# EAGLE design 150224_AriloRX_REV2_0_0_V2 (EAGLE 6.5.0)
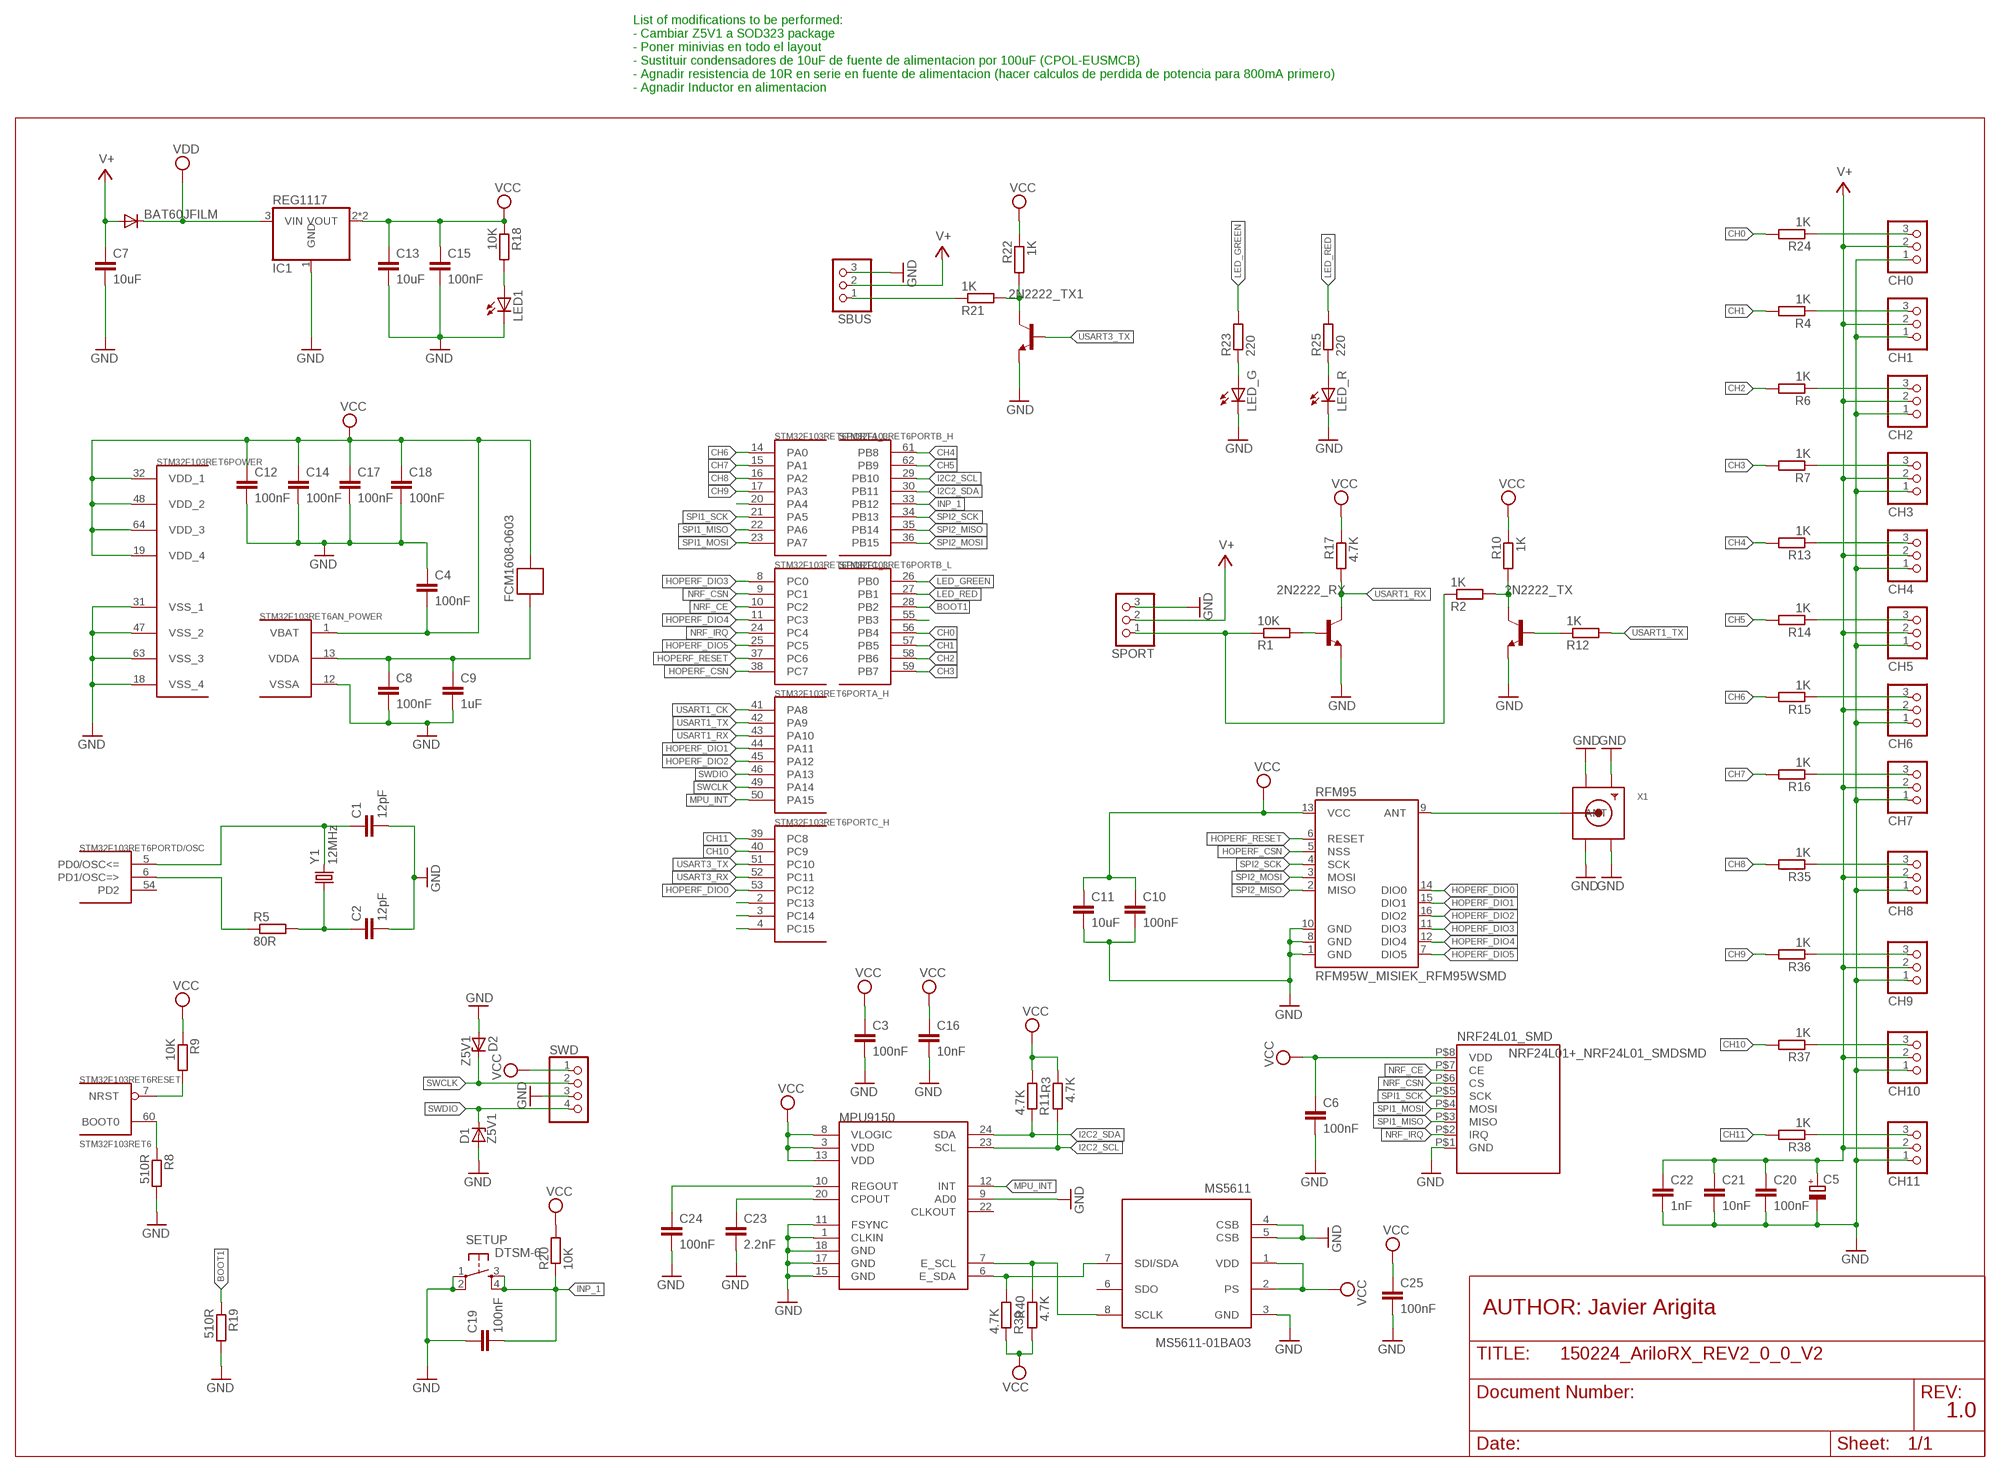
[diagram p0: schematic, sheet 1]

## Parts
2N2222_RX  MMBT2222ALT1-NPN-SOT23-BEC  [SOT23-BEC]
2N2222_TX  MMBT2222ALT1-NPN-SOT23-BEC  [SOT23-BEC]
2N2222_TX1  MMBT2222ALT1-NPN-SOT23-BEC  [SOT23-BEC]
BAT60JFILM  DIODE-SOD323-R  [SOD323-R]
C1  12pF  RESISTOR_C-EUC0603  [RESISTOR_C0603]
C2  12pF  RESISTOR_C-EUC0603  [RESISTOR_C0603]
C3  100nF  RESISTOR_C-EUC0603  [RESISTOR_C0603]
C4  100nF  RESISTOR_C-EUC0603  [RESISTOR_C0603]
C5  CPOL-EUSMCB  [SMC_B]
C6  100nF  RESISTOR_C-EUC0603  [RESISTOR_C0603]
C7  10uF  RESISTOR_C-EUC3216  [RESISTOR_C3216]
C8  100nF  RESISTOR_C-EUC0603  [RESISTOR_C0603]
C9  1uF  RESISTOR_C-EUC0603  [RESISTOR_C0603]
C10  100nF  RESISTOR_C-EUC0603  [RESISTOR_C0603]
C11  10uF  RESISTOR_C-EUC3216  [RESISTOR_C3216]
C12  100nF  RESISTOR_C-EUC0603  [RESISTOR_C0603]
C13  10uF  RESISTOR_C-EUC3216  [RESISTOR_C3216]
C14  100nF  RESISTOR_C-EUC0603  [RESISTOR_C0603]
C15  100nF  RESISTOR_C-EUC0603  [RESISTOR_C0603]
C16  10nF  RESISTOR_C-EUC0603  [RESISTOR_C0603]
C17  100nF  RESISTOR_C-EUC0603  [RESISTOR_C0603]
C18  100nF  RESISTOR_C-EUC0603  [RESISTOR_C0603]
C19  100nF  RESISTOR_C-EUC0603  [RESISTOR_C0603]
C20  100nF  RESISTOR_C-EUC0603  [RESISTOR_C0603]
C21  10nF  RESISTOR_C-EUC0603  [RESISTOR_C0603]
C22  1nF  RESISTOR_C-EUC0603  [RESISTOR_C0603]
C23  2.2nF  RESISTOR_C-EUC0603  [RESISTOR_C0603]
C24  100nF  RESISTOR_C-EUC0603  [RESISTOR_C0603]
C25  100nF  RESISTOR_C-EUC0603  [RESISTOR_C0603]
CH0  PINHD-1X3  [1X03]
CH1  PINHD-1X3  [1X03]
CH2  PINHD-1X3  [1X03]
CH3  PINHD-1X3  [1X03]
CH4  PINHD-1X3  [1X03]
CH5  PINHD-1X3  [1X03]
CH6  PINHD-1X3  [1X03]
CH7  PINHD-1X3  [1X03]
CH8  PINHD-1X3  [1X03]
CH9  PINHD-1X3  [1X03]
CH10  PINHD-1X3  [1X03]
CH11  PINHD-1X3  [1X03]
D1  Z5V1  ZENER-DIODESOD80C  [SOD80C]
D2  Z5V1  ZENER-DIODESOD80C  [SOD80C]
FCM1608-0603  FERRITE-BEAD  [R0603]
IC1  REG1117  [SOT223]
LED1  LED_LEDCHIP-LED0603  [LED_CHIP-LED0603]
LED_G  LEDCHIP-LED0603  [CHIP-LED0603]
LED_R  LEDCHIP-LED0603  [CHIP-LED0603]
MPU9150  MPU-9150QFN-24-NP  [QFN-24-NP]
MS5611  MS5611-01BA03  [SON125P300X500X100-8N]
NRF24L01_SMD  NRF24L01+_NRF24L01_SMDSMD  [NRF24L01+_NRF24L01_SMD]
R1  10K  RCL_R-EU_R0603  [RCL_R0603]
R2  1K  RCL_R-EU_R0603  [RCL_R0603]
R3  4.7K  RCL_R-EU_R0603  [RCL_R0603]
R4  1K  RCL_R-EU_R0603  [RCL_R0603]
R5  80R  RCL_R-EU_R0603  [RCL_R0603]
R6  1K  RCL_R-EU_R0603  [RCL_R0603]
R7  1K  RCL_R-EU_R0603  [RCL_R0603]
R8  510R  RCL_R-EU_R0603  [RCL_R0603]
R9  10K  RCL_R-EU_R0603  [RCL_R0603]
R10  1K  RCL_R-EU_R0603  [RCL_R0603]
R11  4.7K  RCL_R-EU_R0603  [RCL_R0603]
R12  1K  RCL_R-EU_R0603  [RCL_R0603]
R13  1K  RCL_R-EU_R0603  [RCL_R0603]
R14  1K  RCL_R-EU_R0603  [RCL_R0603]
R15  1K  RCL_R-EU_R0603  [RCL_R0603]
R16  1K  RCL_R-EU_R0603  [RCL_R0603]
R17  4.7K  RCL_R-EU_R0603  [RCL_R0603]
R18  10K  RCL_R-EU_R0603  [RCL_R0603]
R19  510R  RCL_R-EU_R0603  [RCL_R0603]
R20  10K  RCL_R-EU_R0603  [RCL_R0603]
R21  1K  RCL_R-EU_R0603  [RCL_R0603]
R22  1K  RCL_R-EU_R0603  [RCL_R0603]
R23  220  RCL_R-EU_R0603  [RCL_R0603]
R24  1K  RCL_R-EU_R0603  [RCL_R0603]
R25  220  RCL_R-EU_R0603  [RCL_R0603]
R35  1K  RCL_R-EU_R0603  [RCL_R0603]
R36  1K  RCL_R-EU_R0603  [RCL_R0603]
R37  1K  RCL_R-EU_R0603  [RCL_R0603]
R38  1K  RCL_R-EU_R0603  [RCL_R0603]
R39  4.7K  RCL_R-EU_R0603  [RCL_R0603]
R40  4.7K  RCL_R-EU_R0603  [RCL_R0603]
RFM95  RFM95W_MISIEK_RFM95WSMD  [RFM95W_MISIEK_RFM95W_SMD]
SBUS  PINHD-1X3  [1X03]
SETUP  DTSM-6  [DTSM-6]
SPORT  PINHD-1X3  [1X03]
STM32F103RET6  STM32F103RET6  STM32F10XRXT6  [TQFP64]
SWD  PINHD-1X4  [1X04]
X1  SMACONNECTOR_EDGE  [SMA_EDGELAUNCH]
Y1  12MHz  CRYSTAL5X3  [CRYSTAL-SMD-5X3]

## Nets
BOOT1: R19.1 STM32F103RET6.28(PORTB_L:PB2)
CH0: R24.2 STM32F103RET6.56(PORTB_L:PB4)
CH1: R4.2 STM32F103RET6.57(PORTB_L:PB5)
CH2: R6.2 STM32F103RET6.58(PORTB_L:PB6)
CH3: R7.2 STM32F103RET6.59(PORTB_L:PB7)
CH4: R13.2 STM32F103RET6.61(PORTB_H:PB8)
CH5: R14.2 STM32F103RET6.62(PORTB_H:PB9)
CH6: R15.2 STM32F103RET6.14(PORTA_L:PA0)
CH7: R16.2 STM32F103RET6.15(PORTA_L:PA1)
CH8: R35.2 STM32F103RET6.16(PORTA_L:PA2)
CH9: R36.2 STM32F103RET6.17(PORTA_L:PA3)
CH10: R37.2 STM32F103RET6.40(PORTC_H:PC9)
CH11: R38.2 STM32F103RET6.39(PORTC_H:PC8)
GND: 2N2222_RX.E 2N2222_TX1.E 2N2222_TX.E C1.2 C2.2 C3.2 C4.1 C5.- C6.2 C7.2 C8.2 C9.2 C10.2 C11.2 C12.2 C13.2 C14.2 C15.2 C16.2 C17.2 C18.2 C19.1 C20.2 C21.2 C22.2 C23.2 C24.2 C25.2 CH0.1 CH1.1 CH2.1 CH3.1 CH4.1 CH5.1 CH6.1 CH7.1 CH8.1 CH9.1 CH10.1 CH11.1 D1.A D2.A IC1.1(GND) LED1.C LED_G.C LED_R.C MPU9150.1(CLKIN) MPU9150.9(AD0) MPU9150.11(FSYNC) MPU9150.15(GND) MPU9150.17(GND) MPU9150.18(GND) MS5611.3(GND) MS5611.4(CSB) MS5611.5(CSB) NRF24L01_SMD.P$1(GND) R8.2 R19.2 RFM95.1(GND) RFM95.8(GND) RFM95.10(GND) SBUS.3 SETUP.1 SETUP.2 SPORT.3 STM32F103RET6.12(AN_POWER:VSSA) STM32F103RET6.18(POWER:VSS_4) STM32F103RET6.31(POWER:VSS_1) STM32F103RET6.47(POWER:VSS_2) STM32F103RET6.63(POWER:VSS_3) SWD.3 X1.GND@1(GND4) X1.GND@2(GND3) X1.GND@3(GND2) X1.GND@4(GND1)
HOPERF_CSN: RFM95.5(NSS) STM32F103RET6.38(PORTC_L:PC7)
HOPERF_DIO0: RFM95.14(DIO0) STM32F103RET6.53(PORTC_H:PC12)
HOPERF_DIO1: RFM95.15(DIO1) STM32F103RET6.44(PORTA_H:PA11)
HOPERF_DIO2: RFM95.16(DIO2) STM32F103RET6.45(PORTA_H:PA12)
HOPERF_DIO3: RFM95.11(DIO3) STM32F103RET6.8(PORTC_L:PC0)
HOPERF_DIO4: RFM95.12(DIO4) STM32F103RET6.11(PORTC_L:PC3)
HOPERF_DIO5: RFM95.7(DIO5) STM32F103RET6.25(PORTC_L:PC5)
HOPERF_RESET: RFM95.6(RESET) STM32F103RET6.37(PORTC_L:PC6)
I2C2_SCL: MPU9150.23(SCL) R3.2 STM32F103RET6.29(PORTB_H:PB10)
I2C2_SDA: MPU9150.24(SDA) R11.1 STM32F103RET6.30(PORTB_H:PB11)
INP_1: C19.2 R20.1 SETUP.3 SETUP.4 STM32F103RET6.33(PORTB_H:PB12)
LED_GREEN: R23.2 STM32F103RET6.26(PORTB_L:PB0)
LED_RED: R25.2 STM32F103RET6.27(PORTB_L:PB1)
MPU_INT: MPU9150.12(INT) STM32F103RET6.50(PORTA_H:PA15)
N$1: C1.1 STM32F103RET6.5(PORTD/OSC:PD0/OSC<=) Y1.3
N$2: R5.1 STM32F103RET6.6(PORTD/OSC:PD1/OSC=>)
N$3: C2.1 R5.2 Y1.1
N$4: R8.1 STM32F103RET6.60(RESET:BOOT0)
N$5: 2N2222_TX.C R2.2 R10.2
N$6: STM32F103RET6.20(PORTA_L:PA4)
N$7: RFM95.9(ANT) X1.P(ANT)
N$8: 2N2222_TX.B R12.1
N$9: CH0.3 R24.1
N$10: LED1.A R18.2
N$11: 2N2222_TX1.C R21.2 R22.2
N$12: LED_G.A R23.1
N$13: CH8.3 R35.1
N$14: R1.1 R2.1 SPORT.1
N$15: LED_R.A R25.1
N$16: 2N2222_RX.B R1.2
N$17: C8.1 C9.1 FCM1608-0603.2 STM32F103RET6.13(AN_POWER:VDDA)
N$20: STM32F103RET6.2(PORTC_H:PC13)
N$21: CH2.3 R6.1
N$22: STM32F103RET6.3(PORTC_H:PC14)
N$23: CH4.3 R13.1
N$24: STM32F103RET6.4(PORTC_H:PC15)
N$25: CH9.3 R36.1
N$26: CH10.3 R37.1
N$27: CH11.3 R38.1
N$28: MPU9150.7(E_SCL) MS5611.8(SCLK) R40.1
N$29: MPU9150.6(E_SDA) MS5611.7(SDI/SDA) R39.2
N$30: STM32F103RET6.55(PORTB_L:PB3)
N$31: CH3.3 R7.1
N$32: CH6.3 R15.1
N$33: C23.1 MPU9150.20(CPOUT)
N$34: CH5.3 R14.1
N$35: CH7.3 R16.1
N$40: C24.1 MPU9150.10(REGOUT)
N$53: CH1.3 R4.1
NRF_CE: NRF24L01_SMD.P$7(CE) STM32F103RET6.10(PORTC_L:PC2)
NRF_CSN: NRF24L01_SMD.P$6(CS) STM32F103RET6.9(PORTC_L:PC1)
NRF_IRQ: NRF24L01_SMD.P$2(IRQ) STM32F103RET6.24(PORTC_L:PC4)
NSRST: R9.2 STM32F103RET6.7(RESET:NRST)
SBUS: R21.1 SBUS.1
SPI1_MISO: NRF24L01_SMD.P$3(MISO) STM32F103RET6.22(PORTA_L:PA6)
SPI1_MOSI: NRF24L01_SMD.P$4(MOSI) STM32F103RET6.23(PORTA_L:PA7)
SPI1_SCK: NRF24L01_SMD.P$5(SCK) STM32F103RET6.21(PORTA_L:PA5)
SPI2_MISO: RFM95.2(MISO) STM32F103RET6.35(PORTB_H:PB14)
SPI2_MOSI: RFM95.3(MOSI) STM32F103RET6.36(PORTB_H:PB15)
SPI2_SCK: RFM95.4(SCK) STM32F103RET6.34(PORTB_H:PB13)
SWCLK: D2.C STM32F103RET6.49(PORTA_H:PA14) SWD.2
SWDIO: D1.C STM32F103RET6.46(PORTA_H:PA13) SWD.4
USART1_CK: STM32F103RET6.41(PORTA_H:PA8)
USART1_RX: 2N2222_RX.C R17.2 STM32F103RET6.43(PORTA_H:PA10)
USART1_TX: R12.2 STM32F103RET6.42(PORTA_H:PA9)
USART3_RX: STM32F103RET6.52(PORTC_H:PC11)
USART3_TX: 2N2222_TX1.B STM32F103RET6.51(PORTC_H:PC10)
V+: BAT60JFILM.A C5.+ C7.1 C20.1 C21.1 C22.1 CH0.2 CH1.2 CH2.2 CH3.2 CH4.2 CH5.2 CH6.2 CH7.2 CH8.2 CH9.2 CH10.2 CH11.2 SBUS.2 SPORT.2
VCC: C3.1 C4.2 C6.1 C10.1 C11.1 C12.1 C13.1 C14.1 C15.1 C16.1 C17.1 C18.1 C25.1 FCM1608-0603.1 IC1.2(VOUT) IC1.4(VOUT) MPU9150.3(VDD) MPU9150.8(VLOGIC) MPU9150.13(VDD) MS5611.1(VDD) MS5611.2(PS) NRF24L01_SMD.P$8(VDD) R3.1 R9.1 R10.1 R11.2 R17.1 R18.1 R20.2 R22.1 R39.1 R40.2 RFM95.13(VCC) STM32F103RET6.1(AN_POWER:VBAT) STM32F103RET6.19(POWER:VDD_4) STM32F103RET6.32(POWER:VDD_1) STM32F103RET6.48(POWER:VDD_2) STM32F103RET6.64(POWER:VDD_3) SWD.1
VDD: BAT60JFILM.C IC1.3(VIN)
Unconnected: MPU9150.22(CLKOUT) MS5611.6(SDO) STM32F103RET6.54(PORTD/OSC:PD2)

## Notes on the sheet
- List of modifications to be performed:
  - Cambiar Z5V1 a SOD323 package
  - Poner minivias en todo el layout
  - Sustituir condensadores de 10uF de fuente de alimentacion por 100uF (CPOL-EUSMCB)
  - Agnadir resistencia de 10R en serie en fuente de alimentacion (hacer calculos de perdida de potencia para 800mA primero)
  - Agnadir Inductor en alimentacion
- AUTHOR: Javier Arigita
- 1.0

## Library data of the parts
2N2222_RX 2N2222_TX 2N2222_TX1 = transistor:*-NPN-: NPN Transistror BF959 corrected 2008.03.06
BAT60JFILM = diode:DIODE-: DIODE
C1-C4 C6-C25 = AriloTX:RESISTOR_C-EU: CAPACITOR, European symbol
C5 = rcl:CPOL-EU: POLARIZED CAPACITOR, European symbol
CH0 CH1-CH11 SBUS SPORT = pinhead_rc:PINHD-1X3: PIN HEADER
D1 D2 = diode:ZENER-DIODE: Z-Diode
FCM1608-0603 = BaseApp:FERRITE-BEAD
IC1 = CEDT:REG1117: 800mA and 1A Low Dropout (LDO) Positive Regulator 1.8V, 2.5V, 2.85V, 3.3V, 5V, and Adj
LED1 = AriloTX:LED_LED: LED OSRAM: - CHIPLED LG R971, LG N971, LY N971, LG Q971, LY Q971, LO R971, LY R971 LH N974, LH R974 LS Q976, LO Q976, LY Q976 LO Q996 - Hyper CHIPLED LW Q18S LB Q993, LB Q99A, LB R99A - SideLED LS A670, LO A670, LY A670, LG A670, LP A670 LB A673, LV A673, LT A673, LW A673 LH A674 LY A675 LS A676, LA A676, LO A676, LY A676, LW A676 LS A679, LY A679, LG A679 - Hyper Micro SIDELED® LS Y876, LA Y876, LO Y876, LY Y876 LT Y87S - SmartLED LW L88C, LW L88S LB L89C, LB L89S, LG L890 LS L89K, LO L89K, LY L89K LS L896, LA L896, LO L896, LY L896 - TOPLED LS T670, LO T670, LY T670, LG T670, LP T670 LSG T670, LSP T670, LSY T670, LOP T670, LYG T670 LG T671, LOG T671, LSG T671 LB T673, LV T673, LT T673, LW T673 LH T674 LS T676, LA T676, LO T676, LY T676, LB T676, LH T676, LSB T676, LW T676 LB T67C, LV T67C, LT T67C, LS T67K, LO T67K, LY T67K, LW E67C LS E67B, LA E67B, LO E67B, LY E67B, LB E67C, LV E67C, LT E67C LW T67C LS T679, LY T679, LG T679 LS T770, LO T770, LY T770, LG T770, LP T770 LB T773, LV T773, LT T773, LW T773 LH T774 LS E675, LA E675, LY E675, LS T675 LS T776, LA T776, LO T776, LY T776, LB T776 LHGB T686 LT T68C, LB T68C - Hyper Mini TOPLED® LB M676 - Mini TOPLED Santana® LG M470 LS M47K, LO M47K, LY M47K Source: http://www.osram.convergy.de LUXEON: - LUMILED® LXK2-PW12-R00, LXK2-PW12-S00, LXK2-PW14-U00, LXK2-PW14-V00 LXK2-PM12-R00, LXK2-PM12-S00, LXK2-PM14-U00 LXK2-PE12-Q00, LXK2-PE12-R00, LXK2-PE12-S00, LXK2-PE14-T00, LXK2-PE14-U00 LXK2-PB12-K00, LXK2-PB12-L00, LXK2-PB12-M00, LXK2-PB14-N00, LXK2-PB14-P00, LXK2-PB14-Q00 LXK2-PR12-L00, LXK2-PR12-M00, LXK2-PR14-Q00, LXK2-PR14-R00 LXK2-PD12-Q00, LXK2-PD12-R00, LXK2-PD12-S00 LXK2-PH12-R00, LXK2-PH12-S00 LXK2-PL12-P00, LXK2-PL12-Q00, LXK2-PL12-R00 Source: www.luxeon.com KINGBRIGHT: KA-3528ASYC Source: www.kingbright.com
LED_G LED_R = led:LED: LED OSRAM: - CHIPLED LG R971, LG N971, LY N971, LG Q971, LY Q971, LO R971, LY R971 LH N974, LH R974 LS Q976, LO Q976, LY Q976 LO Q996 - Hyper CHIPLED LW Q18S LB Q993, LB Q99A, LB R99A - SideLED LS A670, LO A670, LY A670, LG A670, LP A670 LB A673, LV A673, LT A673, LW A673 LH A674 LY A675 LS A676, LA A676, LO A676, LY A676, LW A676 LS A679, LY A679, LG A679 - Hyper Micro SIDELED® LS Y876, LA Y876, LO Y876, LY Y876 LT Y87S - SmartLED LW L88C, LW L88S LB L89C, LB L89S, LG L890 LS L89K, LO L89K, LY L89K LS L896, LA L896, LO L896, LY L896 - TOPLED LS T670, LO T670, LY T670, LG T670, LP T670 LSG T670, LSP T670, LSY T670, LOP T670, LYG T670 LG T671, LOG T671, LSG T671 LB T673, LV T673, LT T673, LW T673 LH T674 LS T676, LA T676, LO T676, LY T676, LB T676, LH T676, LSB T676, LW T676 LB T67C, LV T67C, LT T67C, LS T67K, LO T67K, LY T67K, LW E67C LS E67B, LA E67B, LO E67B, LY E67B, LB E67C, LV E67C, LT E67C LW T67C LS T679, LY T679, LG T679 LS T770, LO T770, LY T770, LG T770, LP T770 LB T773, LV T773, LT T773, LW T773 LH T774 LS E675, LA E675, LY E675, LS T675 LS T776, LA T776, LO T776, LY T776, LB T776 LHGB T686 LT T68C, LB T68C - Hyper Mini TOPLED® LB M676 - Mini TOPLED Santana® LG M470 LS M47K, LO M47K, LY M47K Source: http://www.osram.convergy.de LUXEON: - LUMILED® LXK2-PW12-R00, LXK2-PW12-S00, LXK2-PW14-U00, LXK2-PW14-V00 LXK2-PM12-R00, LXK2-PM12-S00, LXK2-PM14-U00 LXK2-PE12-Q00, LXK2-PE12-R00, LXK2-PE12-S00, LXK2-PE14-T00, LXK2-PE14-U00 LXK2-PB12-K00, LXK2-PB12-L00, LXK2-PB12-M00, LXK2-PB14-N00, LXK2-PB14-P00, LXK2-PB14-Q00 LXK2-PR12-L00, LXK2-PR12-M00, LXK2-PR14-Q00, LXK2-PR14-R00 LXK2-PD12-Q00, LXK2-PD12-R00, LXK2-PD12-S00 LXK2-PH12-R00, LXK2-PH12-S00 LXK2-PL12-P00, LXK2-PL12-Q00, LXK2-PL12-R00 Source: www.luxeon.com KINGBRIGHT: KA-3528ASYC Source: www.kingbright.com
MPU9150 = SparkFun-Sensors:MPU-9150: 9DOF (3mag, 3accel, 3rotat). I2C interface.
MS5611 = Measurement-Specialties:MS5611-01BA03: Variometer Module, with stainless steel cap
NRF24L01_SMD = Arilo_TX140810_AriloTX_REV3_0_0_868MHZ_td:NRF24L01+_NRF24L01_SMD
R1-R25 R35-R40 = AriloTX:RCL_R-EU_: RESISTOR, European symbol
RFM95 = AriloTX:RFM95W_MISIEK_RFM95W
SETUP = switch-tact:DTSM-6
STM32F103RET6 = stm32:STM32F10XRXT6: STM32F101/103 64pin LQFP
SWD = pinhead:PINHD-1X4: PIN HEADER
X1 = adafruit:SMACONNECTOR: SMA Connector 90° DIP SMA Connector, 50 Ohm (4UConnector: 07259)
Y1 = SparkFun-FreqCtrl:CRYSTAL: Various standard crystals. Proven footprints. Spark Fun Electronics SKU : COM-00534

## Board
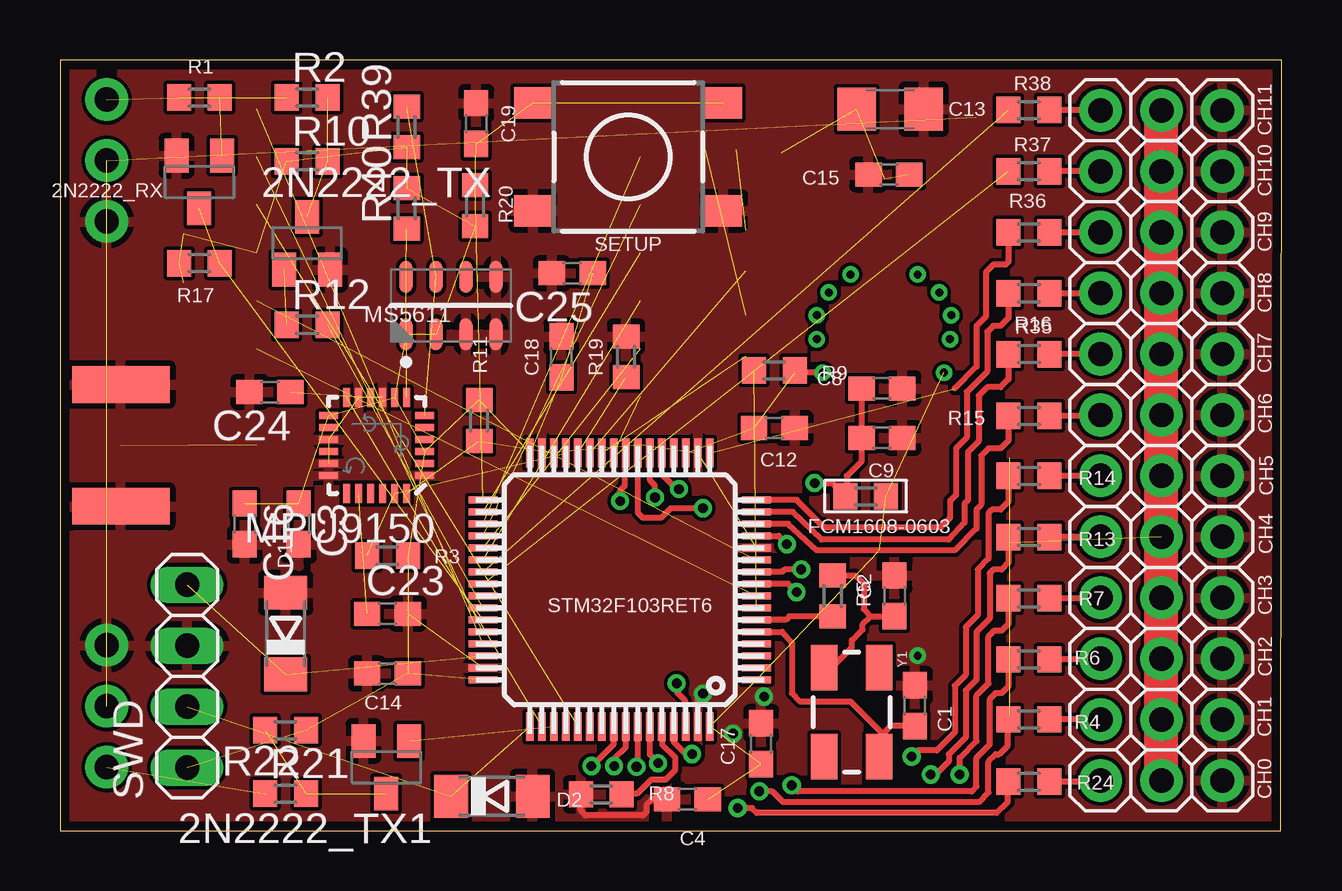
[diagram p1: board, top side]
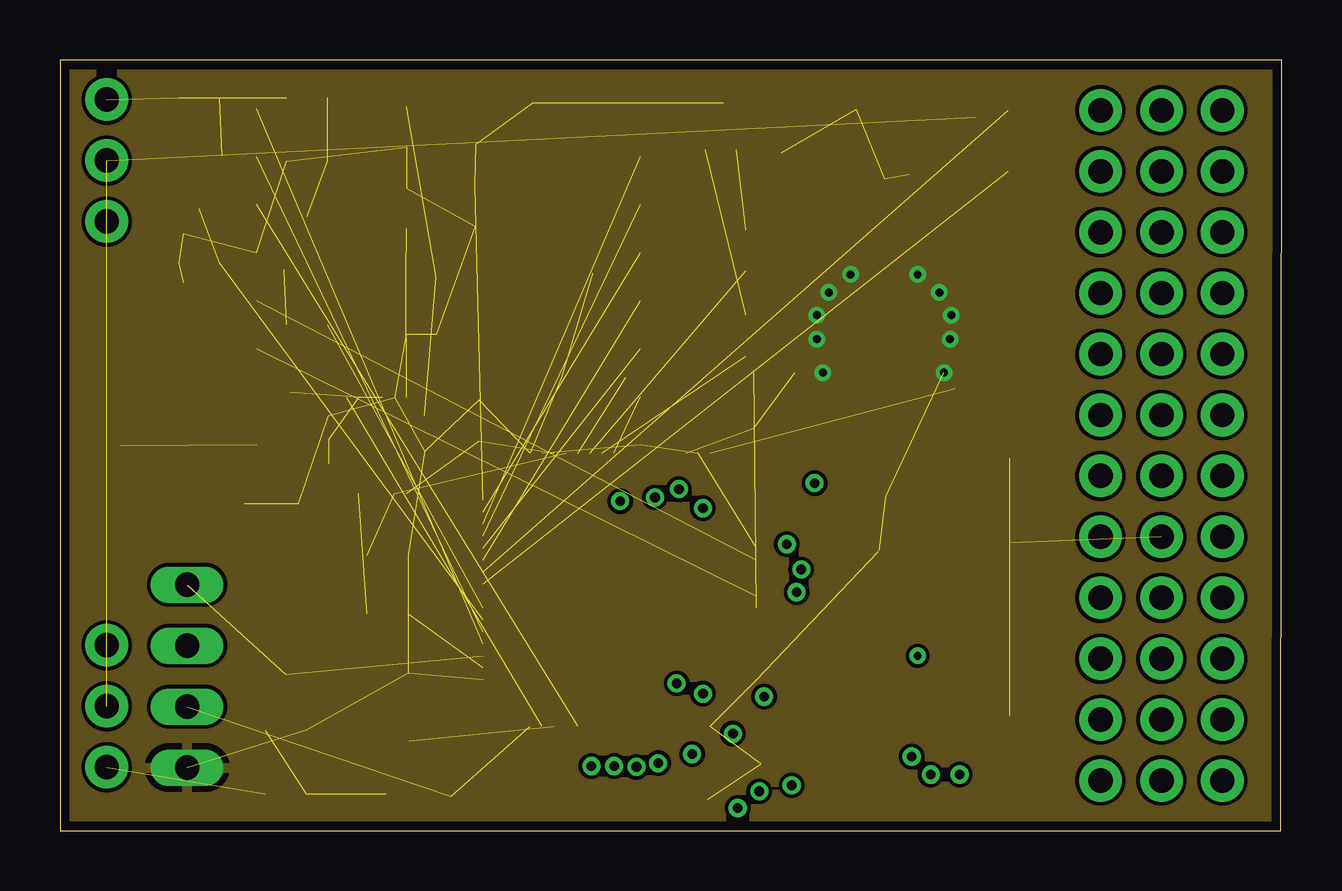
[diagram p2: board, inner layer Route2]
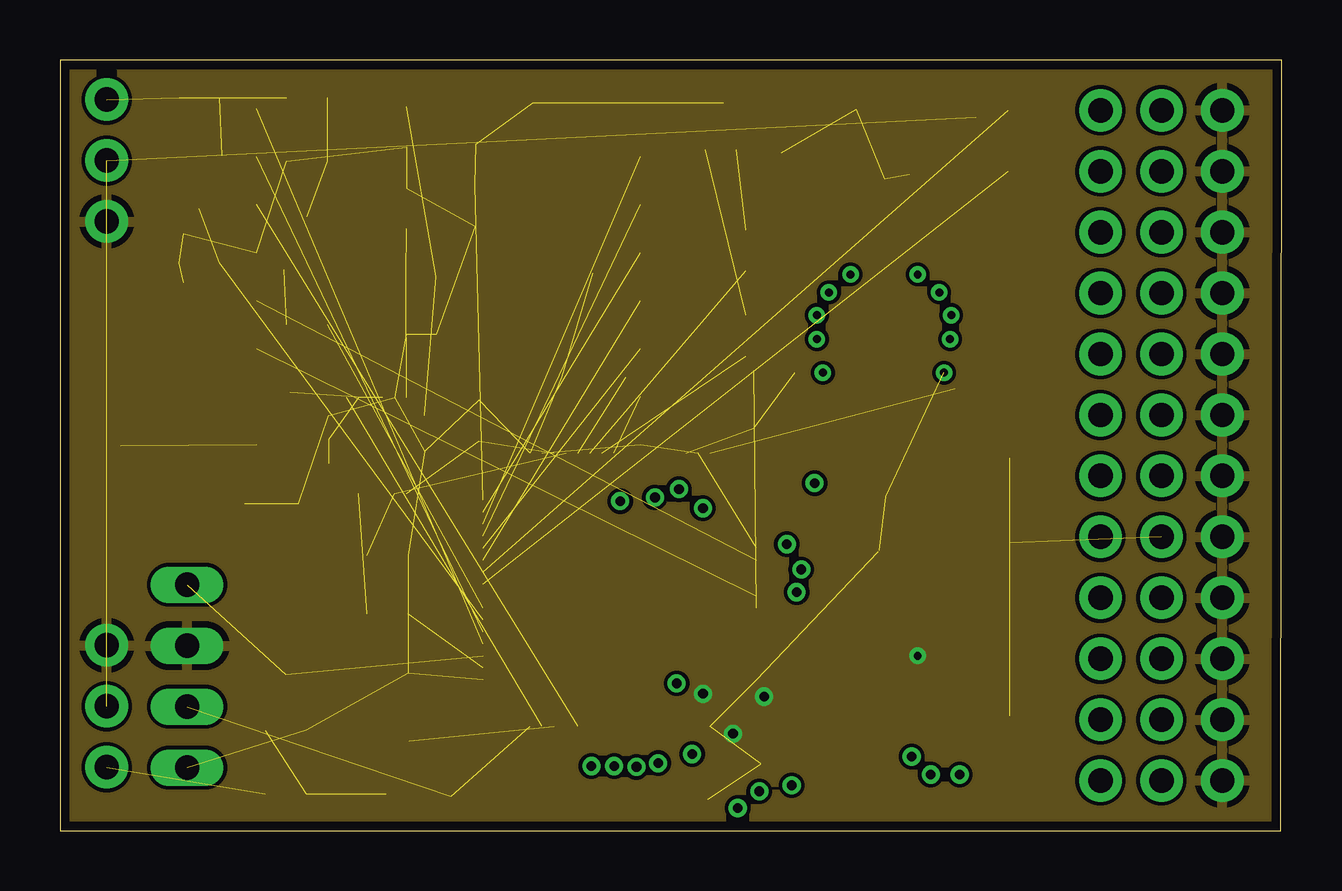
[diagram p3: board, inner layer Route15]
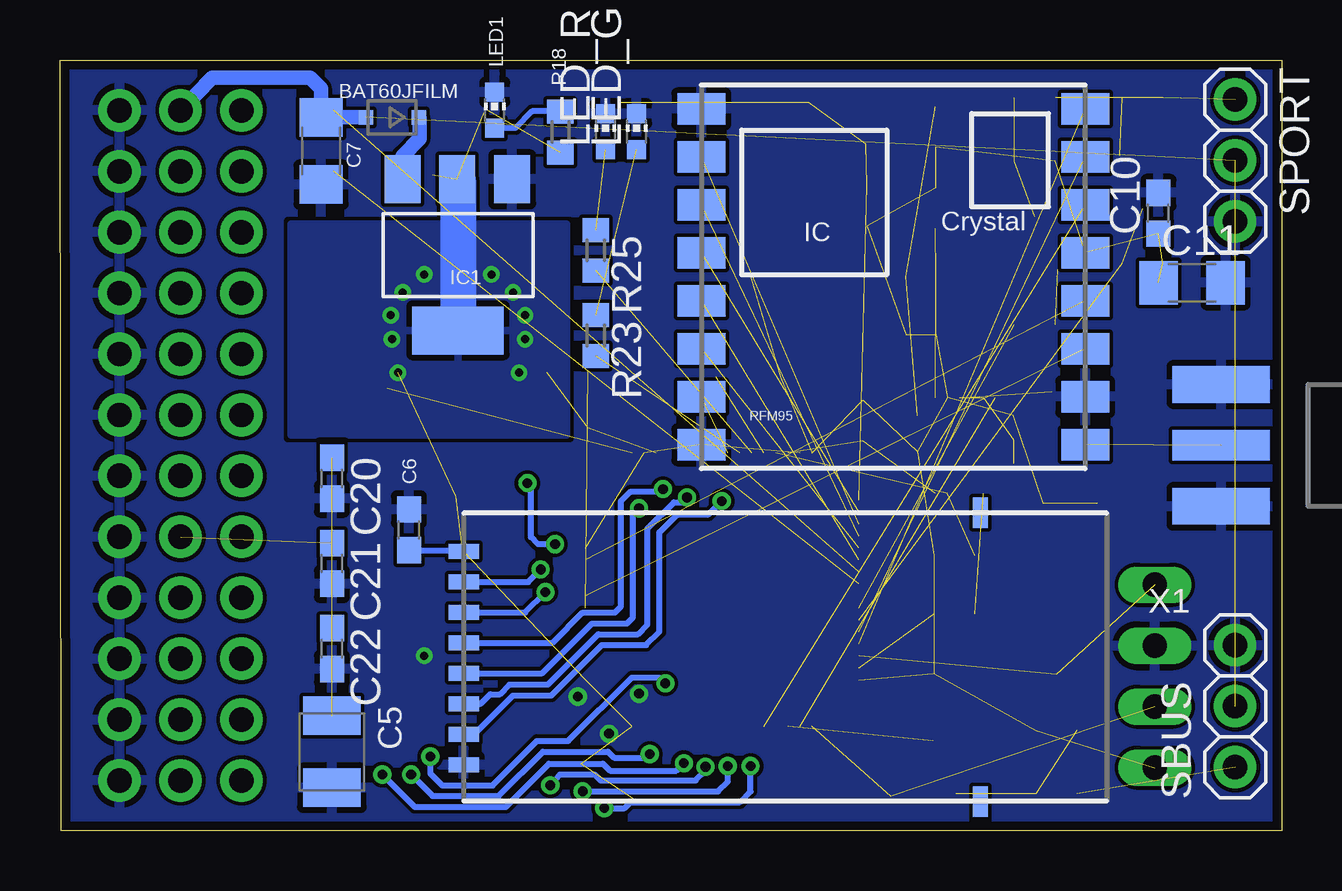
[diagram p4: board, bottom side, seen from below]

Size 50.94 x 32.14 mm. Coordinates in mm from the lower left corner, seen from the top.
Outline: 0,0 50.88,0 50.94,32.14 0,32.14 0,0
Copper layers (1*2*15*16): Top 0.0356mm / dielectric 0.17018125mm / Route2 0.0178mm / dielectric 47mil / Route15 0.0178mm / dielectric 0.17018125mm / Bottom 0.0356mm
Design rules "LaenPCBOrder *": minimum track width 6mil, minimum drill 13mil, track to track 6mil, track to pad 6mil, pad to pad 6mil, via to via 6mil, smd to smd 6mil, copper to edge 15mil, drill to drill 6mil, minimum pad ring 7mil, minimum via ring 7mil, stop-mask expansion 4mil, vias tented up to drill 0mil, thermal gap 10mil

### Footprints (pad centres in the part's own frame; a part is rotated, then mirrored left to right if it is on the bottom)
SOT23-BEC = smd 1 x 1.4: B -0.95,-1.1; C 0,1.1; E 0.95,-1.1
SOD323-R = smd 0.6 x 0.6: A 1.1,0; C -1.1,0
RESISTOR_C0603 = smd 1.1 x 1: 1 -0.85,0; 2 0.85,0
SMC_B = smd 1.6 x 2.4: + -1.5,0; - 1.5,0
RESISTOR_C3216 = smd 1.6 x 1.8: 1 -1.4,0; 2 1.4,0
1X03 = drill 1.016 pad 1.778: 1 -2.54,0; 2 0,0; 3 2.54,0
SOD80C = smd 1.4 x 1.8: A 1.7,0; C -1.7,0
R0603 = smd 1 x 1.1: 1 -0.85,0; 2 0.85,0
SOT223 = smd 1.499 x 2.007: 1 -2.261,-3.15; 2 0.025,-3.15; 3 2.311,-3.15 | smd 3.81 x 2.007: 4 0,3.15
LED_CHIP-LED0603 = smd 0.8 x 0.8: A 0,-0.75; C 0,0.75
CHIP-LED0603 = smd 0.8 x 0.8: A 0,-0.75; C 0,0.75
QFN-24-NP = smd 0.8 x 0.3: 1 -2,1.25; 2 -2,0.75; 3 -2,0.25; 4 -2,-0.25; 5 -2,-0.75; 6 -2,-1.25; 13 2,-1.25; 14 2,-0.75; 15 2,-0.25; 16 2,0.25; 17 2,0.75; 18 2,1.25 | smd 0.3 x 0.8: 7 -1.25,-2; 8 -0.75,-2; 9 -0.25,-2; 10 0.25,-2; 11 0.75,-2; 12 1.25,-2; 19 1.25,2; 20 0.75,2; 21 0.25,2; 22 -0.25,2; 23 -0.75,2; 24 -1.25,2
SON125P300X500X100-8N = smd 1.35 x 0.55: 1 -1.2,1.875; 2 -1.2,0.625; 3 -1.2,-0.625; 4 -1.2,-1.875; 5 1.2,-1.875; 6 1.2,-0.625; 7 1.2,0.625; 8 1.2,1.875
NRF24L01+_NRF24L01_SMD = smd 1.27 x 0.635: P$1 26.807,10.492; P$2 26.807,9.222; P$3 26.807,7.952; P$4 26.807,6.682; P$5 26.807,5.412; P$6 26.807,4.142; P$7 26.807,2.872; P$8 26.807,1.602 | smd 0.635 x 1.27: P$11 5.267,-0.018; P$13 5.267,12.032
RCL_R0603 = smd 1 x 1.1: 1 -0.85,0; 2 0.85,0
RFM95W_MISIEK_RFM95W_SMD = smd 2 x 1.3: 1 -8,7; 2 -8,5; 3 -8,3; 4 -8,1; 5 -8,-1; 6 -8,-3; 7 -8,-5; 8 -8,-7; 9 8,-7; 10 8,-5; 11 8,-3; 12 8,-1; 13 8,1; 14 8,3; 15 8,5; 16 8,7
DTSM-6 = smd 1.55 x 1.3: 1 -3.975,2.25; 2 3.975,2.25; 3 -3.975,-2.25; 4 3.975,-2.25
TQFP64 = smd 1.2 x 0.3: 1 -5.7,3.75; 2 -5.7,3.25; 3 -5.7,2.75; 4 -5.7,2.25; 5 -5.7,1.75; 6 -5.7,1.25; 7 -5.7,0.75; 8 -5.7,0.25; 9 -5.7,-0.25; 10 -5.7,-0.75; 11 -5.7,-1.25; 12 -5.7,-1.75; 13 -5.7,-2.25; 14 -5.7,-2.75; 15 -5.7,-3.25; 16 -5.7,-3.75; 33 5.7,-3.75; 34 5.7,-3.25; 35 5.7,-2.75; 36 5.7,-2.25; 37 5.7,-1.75; 38 5.7,-1.25; 39 5.7,-0.75; 40 5.7,-0.25; 41 5.7,0.25; 42 5.7,0.75; 43 5.7,1.25; 44 5.7,1.75; 45 5.7,2.25; 46 5.7,2.75; 47 5.7,3.25; 48 5.7,3.75 | smd 0.3 x 1.2: 17 -3.75,-5.7; 18 -3.25,-5.7; 19 -2.75,-5.7; 20 -2.25,-5.7; 21 -1.75,-5.7; 22 -1.25,-5.7; 23 -0.75,-5.7; 24 -0.25,-5.7; 25 0.25,-5.7; 26 0.75,-5.7; 27 1.25,-5.7; 28 1.75,-5.7; 29 2.25,-5.7; 30 2.75,-5.7; 31 3.25,-5.7; 32 3.75,-5.7; 49 3.75,5.7; 50 3.25,5.7; 51 2.75,5.7; 52 2.25,5.7; 53 1.75,5.7; 54 1.25,5.7; 55 0.75,5.7; 56 0.25,5.7; 57 -0.25,5.7; 58 -0.75,5.7; 59 -1.25,5.7; 60 -1.75,5.7; 61 -2.25,5.7; 62 -2.75,5.7; 63 -3.25,5.7; 64 -3.75,5.7
1X04 = drill 1.016 long: 1 -3.81,0; 2 -1.27,0; 3 1.27,0; 4 3.81,0
SMA_EDGELAUNCH = smd 4.064 x 1.524: GND@1 2.032,-2.54; GND@2 2.032,2.54 | smd 4.064 x 1.524 bottom: GND@3 2.032,2.54; GND@4 2.032,-2.54 | smd 4.064 x 1.27: P 2.032,0
CRYSTAL-SMD-5X3 = smd 1.9 x 1.1: 1 -1.85,-1.15; 2 1.85,-1.15; 3 1.85,1.15; 4 -1.85,1.15

### Placement (x,y rotation side)
2N2222_RX  5.81,27.05 180 top
2N2222_TX  10.3,24.5 0 top
2N2222_TX1  13.6,2.65 180 top
BAT60JFILM  37.09,29.75 180 bottom
C1  35.64,5.22 90 top
C2  34.79,9.8 90 top
C3  9.95,12.8 270 top
C4  26.15,1.32 0 top
C5  39.6,3.3 270 bottom
C6  36.38,12.55 90 bottom
C7  40.05,28.35 270 bottom
C8  34.26,18.45 0 top
C9  34.26,16.39 0 top
C10  5.15,25.75 90 bottom
C11  3.75,22.85 0 bottom
C12  29.77,16.79 0 top
C13  34.6,30.09 0 top
C14  13.65,6.56 180 top
C15  34.55,27.36 180 top
C16  7.7,12.8 270 top
C17  29.23,3.64 90 top
C18  20.9,19.77 90 top
C19  17.35,29.49 270 top
C20  39.6,14.7 270 bottom
C21  39.6,11.15 270 bottom
C22  39.6,7.6 270 bottom
C23  13.65,9.05 0 top
C24  8.75,18.3 180 top
C25  21.35,23.25 180 top
CH0  45.91,2.1 180 top
CH1  45.91,4.64 180 top
CH2  45.91,7.18 180 top
CH3  45.91,9.72 180 top
CH4  45.91,12.26 180 top
CH5  45.91,14.8 180 top
CH6  45.91,17.34 180 top
CH7  45.91,19.88 180 top
CH8  45.91,22.42 180 top
CH9  45.91,24.96 180 top
CH10  45.91,27.5 180 top
CH11  45.91,30.04 180 top
D1  9.41,8.22 90 top
D2  18,1.44 0 top
FCM1608-0603  33.59,13.95 180 top
IC1  34.35,24.02 180 bottom
LED1  32.81,30.05 0 bottom
LED_G  26.9,29.15 0 bottom
LED_R  28.2,29.15 0 bottom
MPU9150  13.2,16.07 180 top
MS5611  16.3,21.9 90 top
NRF24L01_SMD  7.3,13.25 180 bottom
R1  5.81,30.57 0 top
R2  10.3,30.57 0 top
R3  13.65,11.47 180 top
R4  40.38,4.65 180 top
R5  32.21,9.8 90 top
R6  40.38,7.15 180 top
R7  40.38,9.7 180 top
R8  22.56,1.52 180 top
R9  29.77,19.2 180 top
R10  10.3,27.91 0 top
R11  17.48,17.11 90 top
R12  10.3,21.1 0 top
R13  40.38,12.25 180 top
R14  40.38,14.8 180 top
R15  40.38,17.3 180 top
R16  40.38,19.88 180 top
R17  5.81,23.66 0 top
R18  30.07,29.14 90 bottom
R19  23.6,19.77 90 top
R20  17.3,26.07 270 top
R21  9.4,1.55 0 top
R22  9.4,4.2 180 top
R23  28.6,20.65 270 bottom
R24  40.38,2.05 180 top
R25  28.6,24.2 270 bottom
R35  40.38,22.41 180 top
R36  40.38,24.95 180 top
R37  40.38,27.5 180 top
R38  40.38,30.05 180 top
R39  14.45,29.35 90 top
R40  14.45,25.95 90 top
RFM95  16.2,23.1 0 bottom
SBUS  1.95,5.2 90 bottom
SETUP  23.68,28.1 180 top
SPORT  1.95,27.95 270 bottom
STM32F103RET6  23.34,10.05 180 top
SWD  5.3,6.45 90 top
X1  0.5,16.07 180 bottom
Y1  33,4.95 270 top

### Tracks (layer width: path | path; a pad name or v marks a point on that pad's centre or on a via)
BOOT1  (1 unrouted)
CH0  (via drill 0.4 pad 0.25)
  Top 0.254: v28.25,0.95 28.85,0.95 29.05,0.75 39.05,0.75 39.5,1.2 39.5,2.02 R24.2 | v22.15,2.7 23.09,3.63 STM32F103RET6.56
  Bottom 0.254: v28.25,0.95 27.4,0.95 27.15,1.2 22.6,1.2 22.15,1.65 v22.15,2.7
CH1  (via drill 0.4 pad 0.25)
  Top 0.254: v29.15,1.65 29.7,1.65 30.15,1.2 38.3,1.2 38.7,1.6 38.7,2.9 39,3.2 39.15,3.2 39.5,3.55 39.5,4.62 R4.2 | v23.1,2.7 23.1,3 23.59,3.48 STM32F103RET6.57
  Bottom 0.254: v29.15,1.65 23.5,1.65 23.1,2.05 v23.1,2.7
CH2  (via drill 0.4 pad 0.25)
  Top 0.254: v30.5,1.9 30.75,1.65 38,1.65 38.2,1.85 38.2,3.05 38.75,3.6 38.75,5.5 39,5.75 39.25,5.75 39.55,6.05 39.55,7.13 R6.2 | v24.03,2.67 24.09,2.73 STM32F103RET6.58
  Bottom 0.254: v30.5,1.9 30.1,2.35 28.65,2.35 28.4,2.1 24.44,2.1 24.03,2.51 v24.03,2.67
CH3  (via drill 0.4, 0.4 pad 0.25)
  Top 0.254: v24.93,2.82 24.59,3.17 STM32F103RET6.59 | v37.5,2.35 37.5,3.05 38.2,3.75 38.2,5.65 38.7,6.15 38.7,8.1 38.95,8.35 39.25,8.35 39.55,8.65 39.55,9.69 R7.2
  Bottom 0.254: v24.93,2.82 25.24,2.51 28.01,2.51 28.3,2.8 30.55,2.8 32.35,1 36.15,1 v37.5,2.35
CH4  (via drill 0.4, 0.4 pad 0.25)
  Top 0.254: STM32F103RET6.61 25.59,3.69 26.1,3.2 v26.35,3.2 | R13.2 39.53,11.19 39.25,10.9 38.9,10.9 38.75,10.75 38.75,8.85 38.2,8.3 38.2,6.3 37.75,5.85 37.75,3.9 37.05,3.2 37.05,2.9 36.5,2.35 v36.3,2.35
  Bottom 0.254: v26.35,3.2 26.5,3.05 27.85,3.05 28.1,3.3 30.8,3.3 32.65,1.46 35.41,1.46 v36.3,2.35
CH5  (via drill 0.4)
  Top 0.254: R14.2 39.53,13.73 39.2,13.4 38.85,13.4 38.7,13.25 38.7,11.35 38.25,10.9 38.25,9 37.75,8.5 37.75,6.5 37.3,6.05 37.3,4.1 36.55,3.35 35.75,3.35 v35.5,3.1 | v25.7,6.15 25.7,5.8 26.05,5.45 26.05,4.38 STM32F103RET6.62
  Bottom 0.254: v35.5,3.1 35.5,2.4 35,1.9 32.9,1.9 31.05,3.75 29.75,3.75 27.1,6.4 25.95,6.4 v25.7,6.15
CH6
  Top 0.254: R15.2 39.53,16.29 39.2,15.95 38.7,15.95 38.4,15.65 38.4,13.6 38.2,13.4 38.2,12.6 37.3,11.7 31.55,11.7 30.35,12.8 STM32F103RET6.14
CH7
  Top 0.254: R16.2 39.53,18.84 39.2,18.5 38.65,18.5 38.3,18.15 38.3,16.25 37.85,15.8 37.85,13.8 37.7,13.65 37.7,12.85 37.05,12.15 31.75,12.15 30.55,13.3 STM32F103RET6.15
CH8
  Top 0.254: R35.2 39.53,21.39 39.2,21.05 38.9,21.05 38.65,20.8 38.65,19.15 37.8,18.3 37.8,16.4 37.35,15.95 37.35,14 37.1,13.75 37.1,13.05 36.7,12.65 31.85,12.65 30.7,13.8 STM32F103RET6.16
CH9  (1 unrouted)
  Top 0.254: R36.2 39.53,23.73 39.4,23.6 38.9,23.6 38.6,23.3 38.6,21.45 38.2,21.05 38.2,19.35 37.3,18.45
CH10  (1 unrouted)
CH11  (1 unrouted)
GND  (via drill 0.33, 0.4)  (7 unrouted)
  Top 0.254: STM32F103RET6.63 26.59,5.55 v26.8,5.72 | C4.1 24.68,1.32 24.45,1.1 24.45,0.8 24.3,0.65 21.9,0.65 21.7,0.85 21.7,1.47 R8.2
  other vias: 28.05,4.05 29.35,5.6 35.75,7.3
  pour Bottom (rank 2): 0.48,31.64 50.38,31.64 50.38,0.5 0.48,0.5
  pour Top: 0.48,31.64 50.38,31.64 50.38,0.5 0.48,0.5
  pour Route15: 0.48,31.64 50.38,31.64 50.38,0.5 0.48,0.5
HOPERF_CSN  (1 unrouted)
HOPERF_DIO0  (1 unrouted)
HOPERF_DIO1  (1 unrouted)
HOPERF_DIO2  (1 unrouted)
HOPERF_DIO3  (1 unrouted)
HOPERF_DIO4  (1 unrouted)
HOPERF_DIO5  (1 unrouted)
HOPERF_RESET  (1 unrouted)
I2C2_SCL  (2 unrouted)
I2C2_SDA  (2 unrouted)
INP_1  (4 unrouted)
LED_GREEN  (1 unrouted)
LED_RED  (1 unrouted)
MPU_INT  (1 unrouted)
N$1
  Top 0.254: C1.1 34.62,4.38 34.3,4.05 | 34.3,4.05 34.2,3.15 Y1.3 | STM32F103RET6.5 30.1,8.3 30.5,7.85 30.5,5.75 30.85,5.4 32.95,5.4 34.3,4.05
N$2
  Top 0.254: R5.1 30.4,8.95 30.25,8.8 STM32F103RET6.6
N$3
  Top 0.254: Y1.1 32.15,6.8 33,7.65 33,7.95 33.45,8.4 33.45,8.6 33.8,8.95 | 33.8,8.95 C2.1 | R5.2 33.15,10.65 33.5,10.3 33.5,9.25 33.8,8.95
N$4
  Top 0.254: STM32F103RET6.60 25.1,4.29 25.1,3.59 25.65,3.05 25.65,2.55 25.25,2.15 24.65,2.15 24.05,1.55 23.48,1.55 R8.1
N$5  (2 unrouted)
N$7  (1 unrouted)
N$8  (1 unrouted)
N$9
  Top 0.254: CH0.3 43.32,2.05 R24.1
N$10
  Bottom 0.254: R18.2 30.09,30 31.25,30 31.95,29.3 LED1.A
N$11  (2 unrouted)
N$12  (1 unrouted)
N$13
  Top 0.254: CH8.3 R35.1
N$14  (2 unrouted)
N$15  (1 unrouted)
N$16  (1 unrouted)
N$17  (via drill 0.4)
  Top 0.254: C8.1 C9.1 33.41,15.41 32.8,14.8 32.8,14.02 FCM1608-0603.2 32.19,14.5 v31.45,14.5 | STM32F103RET6.13 29.95,12.3 v30.3,11.95
  Bottom 0.254: v30.3,11.95 31,11.95 31.3,12.25 31.3,14.35 v31.45,14.5
N$21
  Top 0.254: CH2.3 43.34,7.15 R6.1
N$23
  Top 0.254: CH4.3 R13.1
N$25
  Top 0.254: CH9.3 R36.1
N$26
  Top 0.254: CH10.3 R37.1
N$27
  Top 0.254: CH11.3 R38.1
N$28  (2 unrouted)
N$29  (2 unrouted)
N$31
  Top 0.254: CH3.3 43.35,9.7 R7.1
N$32
  Top 0.254: CH6.3 43.33,17.3 R15.1
N$33  (1 unrouted)
N$34
  Top 0.254: CH5.3 R14.1
N$35
  Top 0.254: CH7.3 R16.1
N$40  (1 unrouted)
N$53
  Top 0.254: CH1.3 R4.1
NRF_CE  (via drill 0.4)
  Top 0.254: v30.9,10.9 30.2,10.9 30.1,10.8 STM32F103RET6.10
  Bottom 0.254: NRF24L01_SMD.P$7 31.42,10.38 v30.9,10.9
NRF_CSN  (via drill 0.4)
  Top 0.254: v30.7,9.95 30.35,10.3 STM32F103RET6.9
  Bottom 0.254: NRF24L01_SMD.P$6 31.54,9.11 v30.7,9.95
NRF_IRQ  (via drill 0.4)
  Top 0.254: v23.35,13.75 23.35,14.2 23.55,14.4 23.55,15.71 STM32F103RET6.24
  Bottom 0.254: NRF24L01_SMD.P$2 33.67,4.03 32.05,5.65 30.45,5.65 28.35,7.75 26.5,7.75 25.95,8.3 25.95,12.45 25.2,13.2 23.9,13.2 v23.35,13.75
NSRST  (1 unrouted)
SBUS  (1 unrouted)
SPI1_MISO  (via drill 0.4)
  Top 0.254: v24.8,13.9 24.8,14.4 24.6,14.6 24.6,15.73 STM32F103RET6.22
  Bottom 0.254: NRF24L01_SMD.P$3 33.4,5.3 33,5.7 32.6,5.7 32.2,6.1 30.6,6.1 28.5,8.2 26.85,8.2 26.45,8.6 26.45,12.6 25.35,13.7 25,13.7 v24.8,13.9
SPI1_MOSI  (via drill 0.4)
  Top 0.254: v26.8,13.45 25.45,13.45 25.05,13.05 24.3,13.05 24.1,13.25 24.1,15.73 STM32F103RET6.23
  Bottom 0.254: NRF24L01_SMD.P$4 30.83,6.57 28.75,8.65 27.3,8.65 27.05,8.9 27.05,13.2 v26.8,13.45
SPI1_SCK  (via drill 0.4)
  Top 0.254: v25.8,14.25 25.7,14.25 25.1,14.85 25.1,15.73 STM32F103RET6.21
  Bottom 0.254: NRF24L01_SMD.P$5 30.41,7.84 29.15,9.1 27.8,9.1 27.55,9.35 27.55,13.75 27.15,14.15 25.9,14.15 v25.8,14.25
SPI2_MISO  (1 unrouted)
SPI2_MOSI  (1 unrouted)
SPI2_SCK  (1 unrouted)
SWCLK  (2 unrouted)
SWDIO  (2 unrouted)
USART1_RX  (2 unrouted)
USART1_TX  (1 unrouted)
USART3_TX  (1 unrouted)
V+  (6 unrouted)
  Top 1.422: CH0.2 CH1.2 CH2.2 CH3.2 CH4.2 CH5.2 CH6.2 CH7.2 CH8.2 CH9.2 CH10.2 CH11.2
  Bottom 0.61: CH11.2 44.6,31.4 40.5,31.4 40.05,30.95 C7.1 BAT60JFILM.A
VCC  (via drill 0.33)  (34 unrouted)
  Top 0.254: v31.8,19.1 30.62,19.1 R9.1
  Bottom 0.254: C6.1 34.16,11.7 NRF24L01_SMD.P$8
  Bottom 0.61: IC1.2 34.35,27.14
  Bottom 1.49: 34.35,27.14 IC1.4
  other vias: 31.55,21.5 32.95,23.2 37.15,21.5 31.55,20.5 32.05,22.45 35.75,23.2 36.65,22.45 36.85,19.1 37.1,20.5
  pour Bottom (isolate 0.305): 29.82,16.5 41.3,16.5 41.3,25.3 29.82,25.3
  pour Route2: 0.48,31.64 50.38,31.64 50.38,0.5 0.48,0.5
VDD
  Bottom 0.61: BAT60JFILM.C 35.95,29.71 35.95,28.85 36.66,28.14 IC1.3

### Text on the board
bPlace: AriloRX | (c) J.ARIGITA